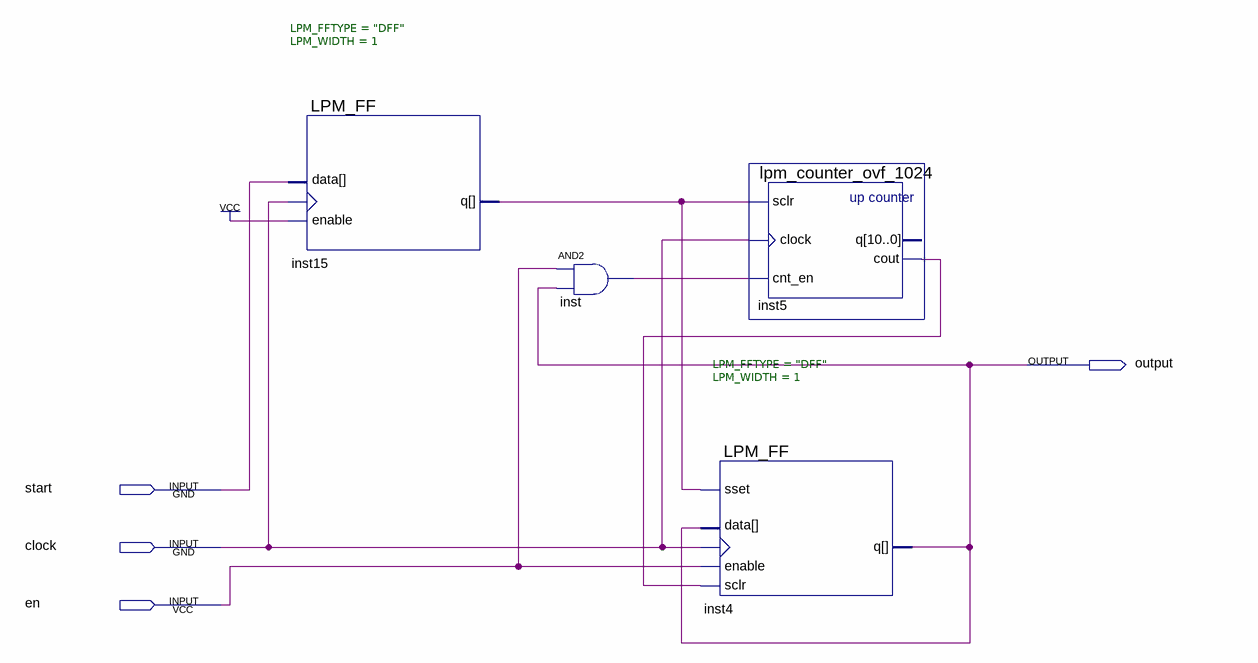
[diagram p0: schematic sheet]
// Quartus schematic monoflop_1024.bdf as structural Verilog: 4 symbols, 4 pins
module monoflop_1024 (
  input  start,
  input  clock,
  input  en,
  output \output 
);

  wire inst5_cout, inst15_q, inst_out;

  LPM_FF #(.LPM_FFTYPE("DFF"), .LPM_WIDTH(1)) inst15 (.enable(1'b1), .clock(clock), .data(start), .q(inst15_q));
  and inst (inst_out, en, \output );
  LPM_FF #(.LPM_FFTYPE("DFF"), .LPM_WIDTH(1)) inst4 (
    .clock(clock), .data(\output ), .enable(en), .sclr(inst5_cout), .sset(inst15_q), .q(\output ));
  lpm_counter_ovf_1024 inst5 (.sclr(inst15_q), .clock(clock), .cnt_en(inst_out), .cout(inst5_cout));  // open: q
endmodule
